# EAGLE design hike data logger v3 (EAGLE 5.11)
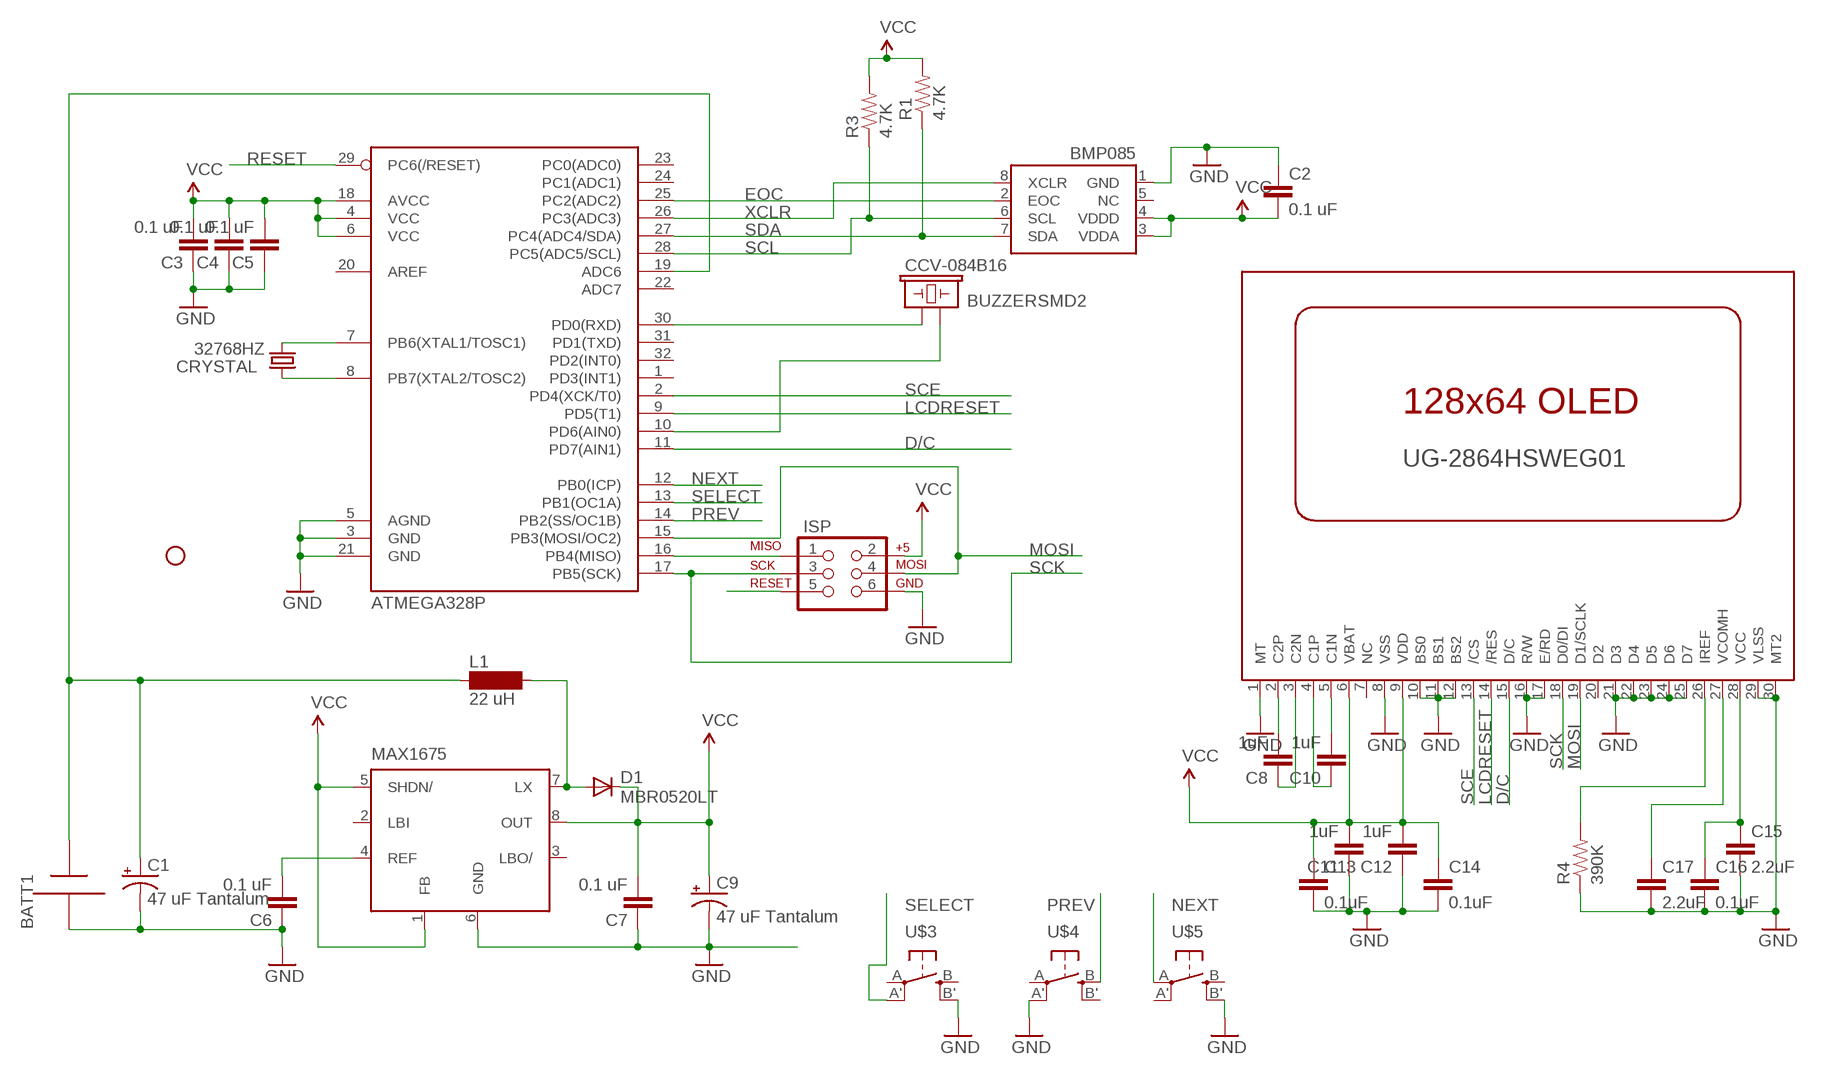
[diagram p0: schematic, sheet 1]

## Parts
ATMEGA328P  ATMEGA168  [TQFP32-08]
BATT1  AAA  [12BH412]
C1  47 uF Tantalum  CAP_POL1206  [EIA3216]
C2  0.1 uF  CAP0805  [0805]
C3  0.1 uF  CAP0805  [0805]
C4  0.1 uF  CAP0805  [0805]
C5  0.1 uF  CAP0805  [0805]
C6  0.1 uF  CAP0805  [0805]
C7  0.1 uF  CAP0805  [0805]
C8  1uF  CAP0805  [0805]
C9  47 uF Tantalum  CAP_POL1206  [EIA3216]
C10  1uF  CAP0805  [0805]
C11  1uF  CAP0805  [0805]
C12  1uF  CAP0805  [0805]
C13  0.1uF  CAP0805  [0805]
C14  0.1uF  CAP0805  [0805]
C15  2.2uF  CAP0805  [0805]
C16  0.1uF  CAP0805  [0805]
C17  2.2uF  CAP0805  [0805]
CCV-084B16  BUZZERSMD2  [BUZZER-CCV]
CRYSTAL  32768HZ  CRYSTALTC38H  [TC38H]
D1  MBR0520LT  [SOD123]
ISP  AVR_SPI_PRG_6PTH  [2X3]
JP5  STAND-OFF  [STAND-OFF]
L1  22 uH  MS85  [MS85]
MAX1675  MAX1674  [UMAX8]
R1  4.7K  RESISTOR0805-RES  [0805]
R3  4.7K  RESISTOR0805-RES  [0805]
R4  390K  RESISTOR0805-RES  [0805]
U$1  UG-2864HSWEG01  [1X30-0.7MM]
U$2  BMP085  [BMP085]
U$3  B3FS-10XX  [B3FS]
U$4  B3FS-10XX  [B3FS]
U$5  B3FS-10XX  [B3FS]

## Nets
D/C: ATMEGA328P.11(PD7(AIN1)) U$1.15(D/C)
EOC: ATMEGA328P.25(PC2(ADC2)) U$2.2(EOC)
GND: ATMEGA328P.3(GND) ATMEGA328P.5(AGND) ATMEGA328P.21(GND) BATT1.- C1.C(-) C2.1 C3.1 C4.1 C5.1 C6.1 C7.1 C9.C(-) C11.1 C12.1 C13.2 C14.2 C15.2 C16.2 C17.2 ISP.6 MAX1675.6(GND) R4.1 U$1.1(MT) U$1.8(VSS) U$1.10(BS0) U$1.11(BS1) U$1.12(BS2) U$1.16(R/W) U$1.17(E/RD) U$1.21(D3) U$1.22(D4) U$1.23(D5) U$1.24(D6) U$1.25(D7) U$1.29(VLSS) U$1.30(MT2) U$2.1(GND) U$3.B' U$4.A' U$5.B'
LCDRESET: ATMEGA328P.9(PD5(T1)) U$1.14(/RES)
MOSI: ATMEGA328P.15(PB3(MOSI/OC2)) ISP.4 U$1.19(D1/SCLK)
N$1: ATMEGA328P.7(PB6(XTAL1/TOSC1)) CRYSTAL.2
N$2: ATMEGA328P.8(PB7(XTAL2/TOSC2)) CRYSTAL.1
N$3: C6.2 MAX1675.4(REF)
N$4: ATMEGA328P.30(PD0(RXD)) CCV-084B16.+
N$5: D1.A L1.2 MAX1675.7(LX)
N$6: ATMEGA328P.19(ADC6) BATT1.+ C1.A(+) L1.1
N$8: ATMEGA328P.16(PB4(MISO)) ISP.1
N$9: ATMEGA328P.10(PD6(AIN0)) CCV-084B16.-
N$11: C8.2 U$1.2(C2P)
N$12: C8.1 U$1.3(C2N)
N$13: C10.2 U$1.5(C1N)
N$14: C10.1 U$1.4(C1P)
N$21: C15.1 C16.1 U$1.28(VCC)
N$22: C17.1 U$1.27(VCOMH)
N$23: R4.2 U$1.26(IREF)
NEXT: ATMEGA328P.12(PB0(ICP)) U$5.A
PREV: ATMEGA328P.14(PB2(SS/OC1B)) U$4.B
RESET: ATMEGA328P.29(PC6(/RESET)) ISP.5
SCE: ATMEGA328P.2(PD4(XCK/T0)) U$1.13(/CS)
SCK: ATMEGA328P.17(PB5(SCK)) ISP.3 U$1.18(D0/DI)
SCL: ATMEGA328P.28(PC5(ADC5/SCL)) R3.1 U$2.6(SCL)
SDA: ATMEGA328P.27(PC4(ADC4/SDA)) R1.1 U$2.7(SDA)
SELECT: ATMEGA328P.13(PB1(OC1A)) U$3.A'
VCC: ATMEGA328P.4(VCC) ATMEGA328P.6(VCC) ATMEGA328P.18(AVCC) C2.2 C3.2 C4.2 C5.2 C7.2 C9.A(+) C11.2 C12.2 C13.1 C14.1 D1.C ISP.2 MAX1675.1(FB) MAX1675.5(SHDN/) MAX1675.8(OUT) R1.2 R3.2 U$1.6(VBAT) U$1.9(VDD) U$2.3(VDDA) U$2.4(VDDD)
XCLR: ATMEGA328P.26(PC3(ADC3)) U$2.8(XCLR)
Unconnected: ATMEGA328P.1(PD3(INT1)) ATMEGA328P.20(AREF) ATMEGA328P.22(ADC7) ATMEGA328P.23(PC0(ADC0)) ATMEGA328P.24(PC1(ADC1)) ATMEGA328P.31(PD1(TXD)) ATMEGA328P.32(PD2(INT0)) MAX1675.2(LBI) MAX1675.3(LBO/) U$1.7(NC) U$1.20(D2) U$2.5(NC) U$3.A U$3.B U$4.A U$4.B' U$5.A' U$5.B

## Library data of the parts
ATMEGA328P = SparkFun:ATMEGA168
BATT1 = adafruit:AAA: AAA PC pin holder Mouser part #12BH412 - but pretty much any 1x AAA battery holder should be the same http://www.ladyada.net/library/pcb/eaglelibrary.html
C1 C9 = SparkFun:CAP_POL: Capacitor Polarized These are standard SMD and PTH capacitors. Normally 10uF, 47uF, and 100uF in electrolytic and tantalum varieties. Always verify the external diameter of the through hole cap, it varies with capacity, voltage, and manufacturer. The EIA devices should be standard.
C2-C8 C10-C17 = SparkFun:CAP: Capacitor Standard 0603 ceramic capacitor, and 0.1" leaded capacitor.
CCV-084B16 = SparkFun:BUZZER: Buzzer 12mm Spark Fun Electronics SKU : Comp-Buzzer
CRYSTAL = SparkFun:CRYSTAL: Crystals Various standard crystals. Proven footprints. Spark Fun Electronics SKU : COM-00534
D1 = diode:MBR0520LT: SCHOTTKY BARRIER RECTIFIER Source: http://onsemi.com .. MBR0520LT1-D.pdf
ISP = SparkFun:AVR_SPI_PRG_6: AVR ISP 6 Pin This is the reduced ISP connector for AVR programming. Common on Arduino. This footprint will take up less PCB space and can be used with a 10-pin to 6-pin adapter such as SKU: BOB-08508
JP5 = SparkFun:STAND-OFF: Stand Off This is the mechanical footprint for a #4 phillips button head screw. Use the keepout ring to avoid running the screw head into surrounding components. SKU : PRT-00447
L1 = inductor-neosid:MS85: INDUCTOR SMD power inductor; OC_FARNELL: unknown; OC_NEWARK: unknown
MAX1675 = maxim:MAX1674: DC/DC CONVERTER; MF: MAXIM; MPN: MAX1674EUA+; OC_FARNELL: 1379864; OC_NEWARK: 23K5719
R1 R3 R4 = SparkFun:RESISTOR: Resistor Basic schematic elements and footprints for 0603, 1206, and PTH resistors.
U$1 = adafruit:UG-2864HSWEG01: UG-2864HSWEG01 OLED display
U$2 = SparkFun:BMP085: BMP085 Pressure Sensor Great little MEMS pressure sensor. SKU: COM-09603
U$3-U$5 = big-mess-o-wires:B3FS-10XX: Omron B3FS-10XX SMD tactile switch

## Board
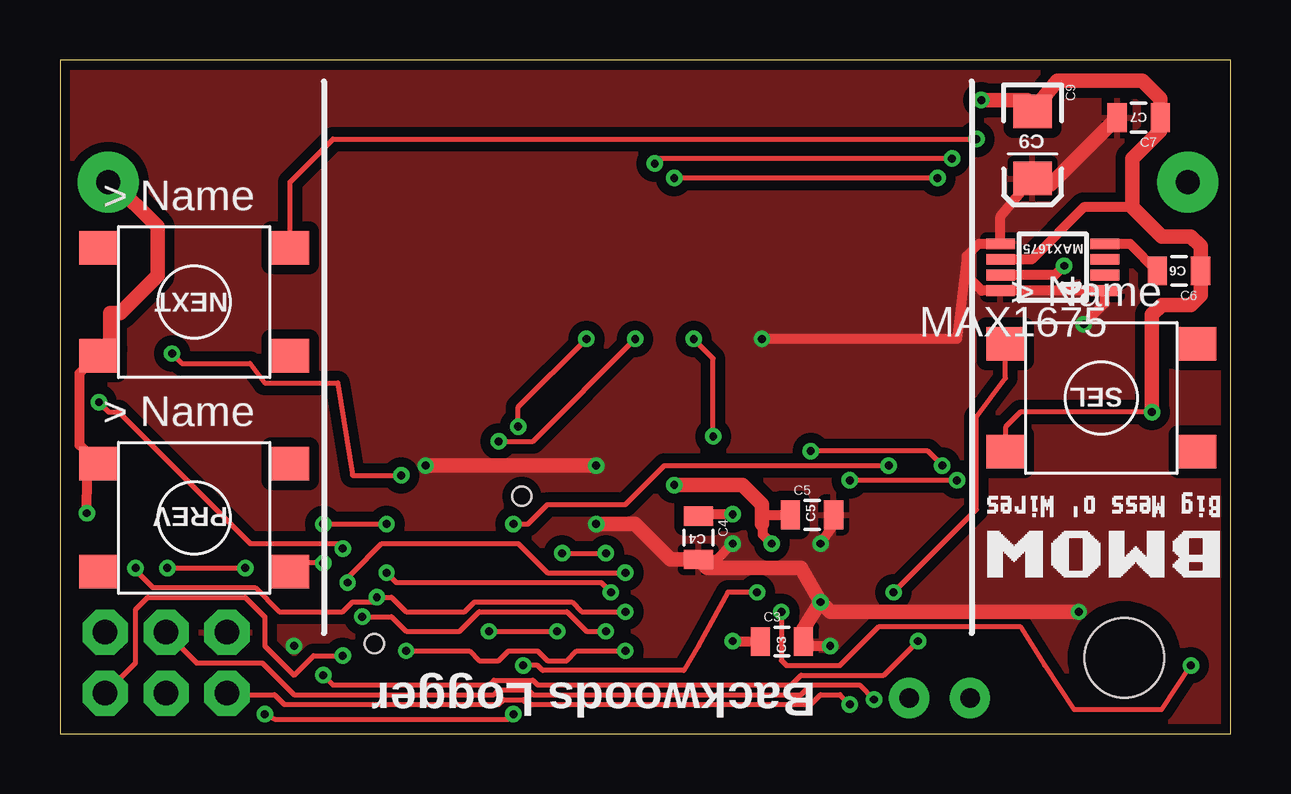
[diagram p1: board, top side]
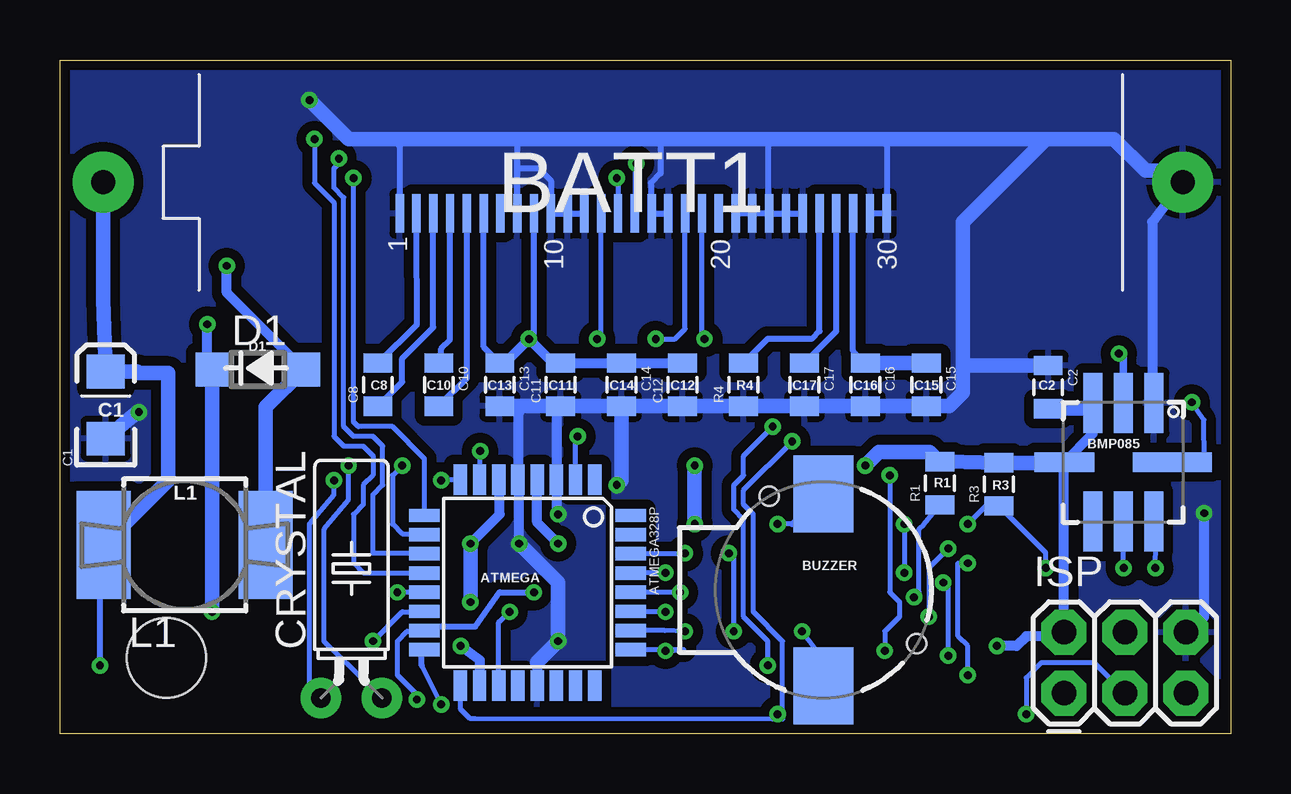
[diagram p2: board, bottom side, seen from below]

Size 48.81 x 28.09 mm. Coordinates in mm from the lower left corner, seen from the top.
Outline: 0,0 48.81,0 48.81,28.09 0,28.09 0,0
Copper layers (1*16): Top 0.0356mm / dielectric 1.5011mm / Bottom 0.0356mm
Design rules "LaenPCBOrder": minimum track width 6mil, minimum drill 13mil, track to track 6mil, track to pad 6mil, pad to pad 6mil, via to via 6mil, smd to smd 6mil, copper to edge 15mil, drill to drill 6mil, minimum pad ring 7mil, minimum via ring 7mil, stop-mask expansion 4mil, vias tented up to drill 0mil, thermal gap 10mil

### Footprints (pad centres in the part's own frame; a part is rotated, then mirrored left to right if it is on the bottom)
TQFP32-08 = smd 1.27 x 0.559: 1 -4.293,2.8; 2 -4.293,2; 3 -4.293,1.2; 4 -4.293,0.4; 5 -4.293,-0.4; 6 -4.293,-1.2; 7 -4.293,-2; 8 -4.293,-2.8; 17 4.293,-2.8; 18 4.293,-2; 19 4.293,-1.2; 20 4.293,-0.4; 21 4.293,0.4; 22 4.293,1.2; 23 4.293,2; 24 4.293,2.8 | smd 0.559 x 1.27: 9 -2.8,-4.293; 10 -2,-4.293; 11 -1.2,-4.293; 12 -0.4,-4.293; 13 0.4,-4.293; 14 1.2,-4.293; 15 2,-4.293; 16 2.8,-4.293; 25 2.8,4.293; 26 2,4.293; 27 1.2,4.293; 28 0.4,4.293; 29 -0.4,4.293; 30 -1.2,4.293; 31 -2,4.293; 32 -2.8,4.293
12BH412 = drill 1 pad 2.54 round: + 22.5,0; - -22.5,0
EIA3216 = smd 1.4 x 1.6: A 1.4,0; C -1.4,0
0805 = smd 0.8 x 1.2: 1 -0.9,0; 2 0.9,0
BUZZER-CCV = smd 3.2 x 2.5: + 4,0; - -4,0 | hole 0.8: -3.9,-2.25; 2.25,3.9
TC38H = drill 0.813 pad 1.676 round: 1 -1.27,0; 2 1.27,0
SOD123 = smd 1.4 x 1.4: A 1.9,0; C -1.9,0
2X3 = drill 1.016 pad 1.88 octagon: 1 0,0; 2 0,2.54; 3 2.54,0; 4 2.54,2.54; 5 5.08,0; 6 5.08,2.54
STAND-OFF = hole 3.302: 0,0
MS85 = smd 4.5 x 2.25: 1 0,-3.383; 2 0,3.383
UMAX8 = smd 0.45 x 1.2: 1 -0.975,-2.175; 2 -0.325,-2.175; 3 0.325,-2.175; 4 0.975,-2.175; 5 0.975,2.175; 6 0.325,2.175; 7 -0.325,2.175; 8 -0.975,2.175
1X30-0.7MM = smd 0.35 x 1.6: 1 -10.15,0; 2 -9.45,0; 3 -8.75,0; 4 -8.05,0; 5 -7.35,0; 6 -6.65,0; 7 -5.95,0; 8 -5.25,0; 9 -4.55,0; 10 -3.85,0; 11 -3.15,0; 12 -2.45,0; 13 -1.75,0; 14 -1.05,0; 15 -0.35,0; 16 0.35,0; 17 1.05,0; 18 1.75,0; 19 2.45,0; 20 3.15,0; 21 3.85,0; 22 4.55,0; 23 5.25,0; 24 5.95,0; 25 6.65,0; 26 7.35,0; 27 8.05,0; 28 8.75,0; 29 9.45,0; 30 10.15,0
BMP085 = smd 2.5 x 0.8: 1 -2.465,1.27; 2 -2.465,0; 3 -2.465,-1.27; 5 2.465,-1.27; 6 2.465,0; 7 2.465,1.27 | smd 0.8 x 2.5: 4 0,-2.465 | smd 0.8 x 3.3: 8 0,2.05
B3FS = smd 1.6 x 1.4: A 4,2.25; A' -4,2.25; B 4,-2.25; B' -4,-2.25

### Placement (x,y rotation side)
ATMEGA328P  29.32,6.3 270 bottom
BATT1  24.52,23 180 bottom
C1  46.9,13.7 90 bottom
C2  7.62,14.45 270 bottom
C3  30.09,3.84 0 top
C4  26.61,8.17 270 top
C5  31.35,9.12 0 top
C6  46.65,19.3 180 top
C7  44.97,25.69 180 top
C8  35.56,14.55 90 bottom
C9  40.54,24.55 270 top
C10  33.02,14.55 270 bottom
C11  27.94,14.55 90 bottom
C12  22.86,14.55 90 bottom
C13  30.48,14.55 270 bottom
C14  25.4,14.55 270 bottom
C15  12.7,14.55 270 bottom
C16  15.24,14.55 270 bottom
C17  17.78,14.55 270 bottom
CCV-084B16  17,6 270 bottom
CRYSTAL  36.66,1.49 0 bottom
D1  40.56,15.19 0 bottom
ISP  6.96,1.69 0 bottom
JP5  44.37,3.16 0 top
L1  43.61,7.87 270 bottom
MAX1675  41.38,19.45 90 top
R1  12.13,10.44 90 bottom
R3  9.67,10.4 90 bottom
R4  20.32,14.55 90 bottom
U$1  24.5,21.69 0 bottom
U$2  4.49,11.32 270 bottom
U$3  43.41,14 0 top
U$4  5.59,9 0 top
U$5  5.59,18 0 top

### Tracks (layer width: path | path; a pad name or v marks a point on that pad's centre or on a via)
D/C  (via drill 0.33)
  Top 0.203: v37.19,23.98 24.99,23.98 v24.79,23.77
  Bottom 0.203: ATMEGA328P.11 33.63,7.52 35.76,7.52 35.76,9.96 35.36,10.36 35.36,11.99 35.76,12.39 36.58,12.39 36.98,12.8 36.98,22.35 37.39,22.76 37.39,23.57 37.19,23.77 v37.19,23.98 | v24.79,23.77 24.85,23.71 U$1.15
EOC  (via drill 0.33)
  Top 0.203: v14.43,3.45 17.07,3.45 17.48,3.05 18.29,3.05 18.69,3.45 19.91,3.45 20.32,3.05 21.13,3.05 21.54,3.45 v23.57,3.45 | v4.67,15.85 5.08,15.44 7.92,15.44 8.53,14.63 11.58,14.63 12.19,10.77 v14.22,10.77
  Bottom 0.203: v14.43,3.45 14.43,4.27 13.82,4.88 13.82,5.49 14.22,5.89 v14.22,10.77 | v23.57,3.45 22.8,3.5 ATMEGA328P.25
  Bottom 0.305: U$2.2 4.49,15.67 v4.67,15.85
GND  (via drill 0.33)
  Top 0.203: U$3.B' 39.41,12.79 40.03,13.41 v45.52,13.41 | U$5.B' 1.9,15.85
  Top 0.406: MAX1675.6 40.5,19.77 42.67,21.95 44.7,21.95 | 1.9,15.85 2.1,16.05 | U$5.B' 1.53,15.75 0.81,15.04 0.81,12.03 U$4.A' 1.14,10.76 v1.12,9.2 | 29.26,8.74 29.29,8.71 29.29,8.31 v29.67,7.92 | C5.1 29.29,9.12 29.26,9.14 | C4.1 26.69,9.14 v28.04,9.14 | C3.1 28.97,3.86 v28.04,3.86
  Top 0.61: C6.1 47.55,18.89 | v45.52,13.41 45.52,17.48 45.92,17.88 47.14,17.88 47.55,18.29 C6.1 | C6.1 47.55,20.32 47.14,20.73 45.92,20.73 44.7,21.95 44.7,23.98 45.87,25.14 C7.1 45.87,26.47 45.11,27.23 41.57,27.23 C9.C 40.32,26.42 v38.41,26.42 | 29.26,8.74 29.26,9.14 29.26,9.55 28.45,10.36 v25.6,10.36 | 2.1,16.05 2.1,17.54 2.51,17.54 4.06,19.1 4.06,21.13 2.2,23 BATT1.-
  Bottom 0.203: ATMEGA328P.21 28.85,1.94
  Bottom 0.254: U$1.29 U$1.30 14.35,24.51 14.63,24.79 | 29.75,23.57 29.75,24.06 | 29.75,23.57 U$1.8 29.75,24.67 29.87,24.79 | 29.75,23.57 28.85,23.57 28.35,23.07 U$1.10 U$1.11 U$1.12 | U$1.1 34.65,24.49 34.95,24.79 | 23.77,24.79 23.77,23.37 24.18,22.96 24.18,21.72 U$1.16 U$1.17 | 19.3,21.74 U$1.23 U$1.24 U$1.25 | 19.3,24.79 19.3,21.74 | 19.3,21.74 19.36,21.69 U$1.22 U$1.21
  Bottom 0.406: 3.29,14.49 3.29,21.34 BATT1.- | ATMEGA328P.3 28.04,10.51 | 29.87,13.65 29.64,13.42 29.72,13.33 ATMEGA328P.5 | ATMEGA328P.3 28.12,13.47 C11.1 | v1.12,9.2 1.12,4.86 ISP.6 | v28.04,9.14 28.12,9.22 ATMEGA328P.3 | 28.92,2.98 ATMEGA328P.21 | v29.67,7.92 29.67,10.36
  Bottom 0.61: C1.C 45.53,13.45 v45.52,13.41 | C15.2 C16.2 C17.2 R4.1 C12.1 C14.2 | C13.2 29.87,13.65 C11.1 C14.2 | C14.2 11.75,13.65 11.18,14.22 11.18,15.44 | 11.18,15.44 11.18,21.34 7.72,24.79 | 7.72,24.79 4.88,24.79 3.56,23.47 2.49,23.47 BATT1.- | 7.72,24.79 14.63,24.79 19.3,24.79 23.77,24.79 29.87,24.79 34.95,24.79 36.78,24.79 v38.41,26.42 | v25.6,10.36 25.4,10.57 C14.2 | 28.92,2.98 v28.04,3.86 28.04,6.3 v29.67,7.92 | C2.1 11.08,15.35 11.18,15.44
  pour Bottom (isolate 0.406): 0.41,27.64 48.36,27.64 48.36,0.41 0.41,0.41
LCDRESET  (via drill 0.33)
  Top 0.203: v36.58,23.16 v25.6,23.16
  Bottom 0.203: ATMEGA328P.9 33.61,11.46 34.95,12.8 36.37,12.8 36.58,13.01 v36.58,23.16 | v25.6,23.16 25.55,23.11 U$1.14
MOSI  (via drill 0.33)
  Top 0.203: ISP.4 4.42,4.22 5.69,2.95 8.43,2.95 9.75,1.63 18.09,1.63 18.29,1.83 19.51,1.83 19.71,1.63 30.89,1.63 31.29,2.03 33.33,2.03 v33.93,1.42 | v19.1,12.8 19.1,13.61 v21.95,16.46 | v29.06,5.89 27.84,5.89 26.62,3.66 26.01,2.64 20.12,2.64 19.91,2.85 v19.3,2.85
  Bottom 0.203: ATMEGA328P.15 33.65,4.27 34.34,4.27 34.75,3.86 34.75,2.44 33.93,1.63 v33.93,1.42 | U$1.19 22.05,16.56 v21.95,16.46 | v19.3,2.85 19.3,3.86 20.32,4.88 20.32,8.94 20.73,9.35 20.73,10.36 20.32,10.77 20.32,11.58 v19.1,12.8
  Bottom 0.254: ATMEGA328P.15 33.12,4.47 31.5,4.47 30.48,5.89 v29.06,5.89
N$1  (via drill 0.33)
  Top 0.203: v36.78,11.18 36.17,11.79 v31.29,11.79
  Bottom 0.203: CRYSTAL.2 37.8,3.83 37.8,8.53 36.78,9.75 v36.78,11.18 | v31.29,11.79 31.32,11.76 ATMEGA328P.7
N$2  (via drill 0.33)
  Top 0.203: v37.39,10.57 v32.92,10.57
  Bottom 0.203: CRYSTAL.1 38.41,2.1 38.41,8.74 37.39,9.96 v37.39,10.57 | v32.92,10.57 32.89,10.59 ATMEGA328P.8
N$3
  Top 0.406: C6.2 45.73,19.3 44.6,20.43 MAX1675.4
N$4  (via drill 0.33)
  Top 0.203: v17.88,4.27 v20.73,4.27 | v20.93,7.52 v22.76,7.52
  Bottom 0.203: 25.01,7.52 ATMEGA328P.30 22.78,7.5 v22.76,7.52 | v17.88,4.27 16.59,2.57 CCV-084B16.+ | v20.73,4.27 20.73,7.32 v20.93,7.52
N$5  (via drill 0.33)
  Top 0.406: MAX1675.7 41.48,19.12 v41.86,19.51
  Bottom 0.406: v41.86,19.51 41.86,18.39 D1.A
  Bottom 0.61: L1.2 40.23,13.62 D1.A
N$6  (via drill 0.33)
  Top 0.203: v30.07,5.08 30.07,3.06 30.28,2.85 32.51,2.85 34.14,4.47 40.03,4.47 41.05,2.85 42.27,1.02 45.92,1.02 v47.14,2.85
  Bottom 0.203: v30.07,5.08 30.48,4.67 30.52,4.63 ATMEGA328P.19
  Bottom 0.254: v47.14,2.85 47.14,7.72 L1.1
  Bottom 0.61: BATT1.+ 47.02,18.11 C1.A 45.58,15.1 45.53,15.05 44.3,15.04 44.3,10.56 L1.1
N$8  (via drill 0.33)
  Top 0.203: ISP.1 7.02,1.63 8.94,1.63 9.35,1.22 18.29,1.22 18.49,1.42 19.3,1.42 19.51,1.22 31.29,1.22 31.7,1.63 32.51,1.63 v32.92,1.22
  Bottom 0.203: v32.92,1.22 33.73,2.85
  Bottom 0.254: 33.73,2.85 33.73,3.38 ATMEGA328P.16
N$9  (via drill 0.33)
  Top 0.203: v18.9,8.74 19.51,8.74 20.32,9.55 23.57,9.55 25.2,11.18 v34.54,11.18
  Bottom 0.203: ATMEGA328P.10 33.65,8.33 34.54,8.33 34.95,8.74 34.95,10.77 v34.54,11.18 | 17.07,8.74 18.29,8.74 v18.9,8.74
  Bottom 0.254: CCV-084B16.- 17.03,10 18.29,8.74
N$11
  Bottom 0.254: U$1.2 33.95,20.93 33.93,17.07 35.55,15.45 C8.2
N$12
  Bottom 0.254: U$1.3 33.25,16.94 34.54,15.65 34.54,14.67 C8.1
N$13
  Bottom 0.254: U$1.5 31.85,14.82 C10.2
N$14
  Bottom 0.254: U$1.4 32.55,16.42 32.92,16.05 32.92,15.56 C10.1
N$21
  Bottom 0.254: C16.1 15.75,15.96 U$1.28
  Bottom 0.61: C15.1 C16.1
N$22
  Bottom 0.254: C17.1 16.45,16.78 U$1.27
N$23
  Bottom 0.254: R4.2 19.32,16.46 17.48,16.46 17.15,16.78 U$1.26
NEXT  (via drill 0.33)
  Top 0.203: v38.2,24.79 11.38,24.79 9.59,23 U$5.A
  Bottom 0.203: ATMEGA328P.12 36.17,6.71 36.58,7.11 36.58,9.14 36.17,9.55 36.17,10.36 35.76,10.77 35.76,11.58 36.17,11.99 36.98,11.99 37.39,12.39 37.39,22.15 38.2,22.96 v38.2,24.79
PREV  (via drill 0.33)
  Top 0.203: v35.76,3.86 34.34,2.44 30.89,2.44 30.48,2.03 19.91,2.03 19.71,2.23 18.09,2.23 17.88,2.03 11.38,2.03 v10.97,2.44 | v10.97,7.11 9.55,7.11 U$4.B
  Bottom 0.203: ATMEGA328P.14 33.63,5.08 34.54,5.08 v35.76,3.86 | v10.97,2.44 10.97,3.66 11.38,4.06 11.38,7.11 v10.97,7.11
RESET  (via drill 0.33)
  Top 0.203: ISP.5 1.89,1.69 3.15,2.95 3.15,5.18 3.66,5.69 7.72,5.69 8.53,4.88 8.53,3.66 9.75,2.44 10.57,3.25 v11.79,3.25 | v11.99,6.3 11.99,6.5 12.19,6.71 13.41,7.92 19.1,7.92 20.32,6.71 v23.57,6.71
  Bottom 0.203: v11.79,3.25 11.79,6.1 v11.99,6.3 | v23.57,6.71 v23.58,6.7 ATMEGA328P.29
SCE  (via drill 0.33)
  Top 0.203: v27.23,12.39 27.23,15.65 v26.42,16.46
  Bottom 0.203: ATMEGA328P.2 27.32,12.3 v27.23,12.39 | v26.42,16.46 26.25,16.62 U$1.13
SCK  (via drill 0.33)
  Top 0.203: v8.53,0.81 8.94,0.61 18.69,0.61 v18.9,0.81 | v18.29,12.19 19.71,12.19 v23.98,16.46
  Bottom 0.203: ISP.3 5.69,2.95 7.92,2.95 8.53,2.34 v8.53,0.81 | ATMEGA328P.17 32.11,1.02 31.71,0.62 31.51,0.62 19.1,0.61 v18.9,0.81 18.69,0.61 18.69,3.86 19.91,5.08 19.91,9.14 20.32,9.55 20.32,10.16 v18.29,12.19 | U$1.18 22.75,16.87 23.16,16.46 v23.98,16.46
SCL  (via drill 0.33)
  Top 0.203: v22.96,5.89 22.55,6.3 14.02,6.3 v13.61,6.71 | v10.97,8.74 v13.61,8.74 | v4.47,6.91 v7.72,6.91
  Bottom 0.203: ATMEGA328P.28 v22.96,5.89 | v13.61,8.74 v13.61,6.71 | v10.97,8.74 10.21,9.5 R3.1 7.72,7.55 v7.72,6.91 | v4.47,6.91 4.49,6.93 U$2.6
SDA  (via drill 0.33)
  Top 0.203: v23.57,5.08 21.74,5.08 21.34,5.49 17.27,5.49 16.87,5.08 14.43,5.08 13.82,5.69 v13.21,5.69 13.01,5.49 12.19,5.49 11.79,5.08 9.14,5.08 8.13,6.1 3.86,6.1 3.15,6.81 v3.15,6.91
  Bottom 0.203: U$2.7 3.1,8.94 v3.15,6.91 | ATMEGA328P.27 25.01,5.08 v23.57,5.08 | R1.1 12.79,8.73 13.01,8.53 13.01,5.89 v13.21,5.69
SELECT  (via drill 0.33)
  Top 0.203: v34.75,5.89 38.2,9.35 38.2,13.21 39.41,14.82 U$3.A'
  Bottom 0.203: ATMEGA328P.13 v34.75,5.89
VCC  (via drill 0.33)
  Top 0.203: 25.2,7.52 25.6,7.11 26.82,7.11
  Top 0.406: 37.8,19.91 38.31,20.43 MAX1675.5 39.2,21.57 C9.A | 37.8,19.91 37.8,19.1 38.42,18.48 MAX1675.8 MAX1675.1 43.55,17.95 v42.67,17.07 | v29.26,16.46 37.39,16.46 37.8,19.91 | C4.2 27.38,7.27 v28.04,7.92 | C3.2 31.22,3.86 31.22,3.78 31.09,3.66 v32.11,3.66 | C5.2 32.25,8.68 v31.7,7.92
  Top 0.61: C7.2 41.28,22.9 C9.A | v15.24,11.18 v22.35,11.18 | v31.7,5.49 30.89,6.91 26.96,6.91 C4.2 25.45,7.27 25.2,7.52 23.98,8.74 v22.35,8.74 | v31.7,5.49 32.11,5.08 v42.47,5.08 | C3.2 31,4.38 v31.7,5.49
  Bottom 0.203: 6.96,10.96 7.3,11.3
  Bottom 0.254: U$1.6 31.15,16.12 C13.1 | U$1.9 29.05,16.67 v29.26,16.46 | ISP.2 6.91,4.23 6.91,4.06
  Bottom 0.305: 5.76,12.51 U$2.3
  Bottom 0.406: D1.C 42.67,15.4 v42.67,17.07 | C13.1 30.27,15.45 v29.26,16.46 28.26,15.45 C11.2 C14.1 C12.2 | 6.91,4.06 8.53,4.06 8.94,3.66 v9.75,3.66 | ATMEGA328P.6 30.48,10.55 30.48,9.14 v31.7,7.92 | v28.04,7.92 28.92,8.8 ATMEGA328P.4 | v32.11,3.66 31.32,3.08 ATMEGA328P.18 | U$2.4 5.76,12.51 | ISP.2 6.96,10.96
  Bottom 0.61: v42.47,5.08 42.46,8.95 D1.C | U$2.4 7.3,11.3 7.58,11.38 7.99,11.3 R3.2 11.86,11.34 R1.2 12.39,11.58 12.56,11.75 14.67,11.75 v15.24,11.18 | v31.7,5.49 v31.7,7.92 | v22.35,11.18 v22.35,8.74 | C2.2 5.99,13.55 U$2.3
  pour Top (isolate 0.406): 0.41,27.64 48.36,27.64 48.36,0.41 0.41,0.41
XCLR  (via drill 0.33)
  Top 0.203: v1.63,13.82 2.03,13.41 2.44,13.41 7.92,7.92 11.58,7.92 v11.79,7.72 | v22.76,4.27 21.95,4.27 21.13,5.08 17.48,5.08 16.66,4.27 14.43,4.27 13.82,4.88 v12.6,4.88
  Bottom 0.203: U$2.8 1.12,11.38 1.13,13.08 v1.63,13.82 | v11.79,7.72 12.6,6.91 v12.6,4.88 | v22.76,4.27 23.6,4.3 ATMEGA328P.26

### Text on the board
tPlace: C7 | C9 | MAX1675 | C6 | NEXT | SEL | PREV | C5 | C4 | C3 | Backwoods Logger
bPlace: D1 | C2 | C15 | C16 | C17 | R4 | C12 | C14 | C11 | C13 | C10 | C8 | C1 | BMP085 | R3 | R1 | L1 | BUZZER | ATMEGA
200bmp: C:/Users/steve/Documents/BMOW/bmow-logo-chunky-white-big.bmp